# EAGLE design mainboard (EAGLE 9.3.1)
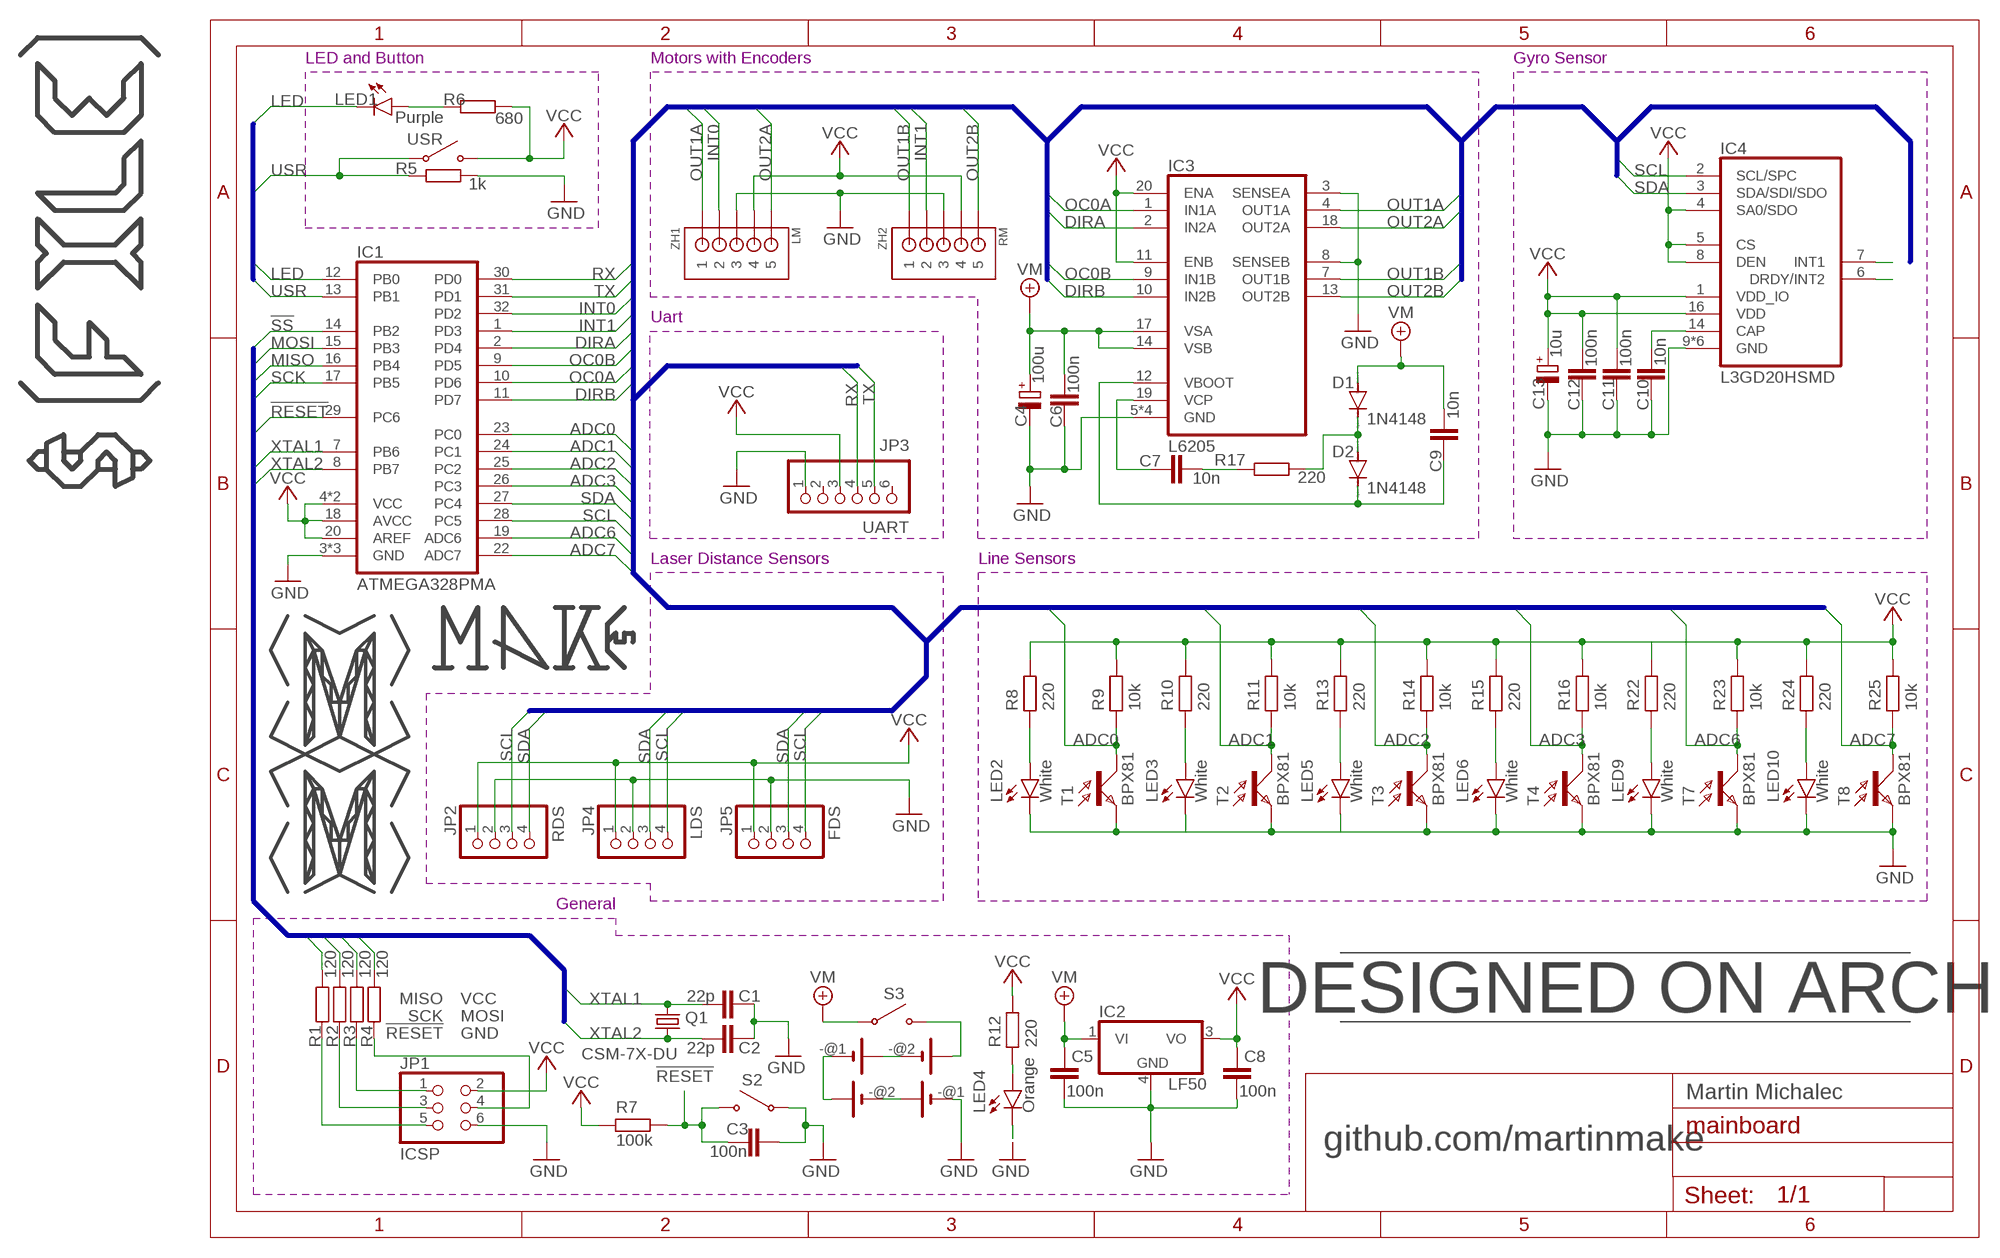
[diagram p0: schematic, sheet 1]

## Parts
BAT1  BATSERIES  [BAT2X18650SERIES]
BAT2  BATSERIES  [BAT2X18650SERIES]
C1  22p  C-EUC1206  [C1206]
C2  22p  C-EUC1206  [C1206]
C3  100n  C-EUC1206  [C1206]
C4  100u  CPOL-EUSMCD  [SMC_D]
C5  100n  C-EUC1206  [C1206]
C6  100n  C-EUC1206  [C1206]
C7  10n  C-EUC1206  [C1206]
C8  100n  C-EUC1206  [C1206]
C9  10n  C-EUC1206  [C1206]
C10  10n  C-EUC1206  [C1206]
C11  100n  C-EUC1206  [C1206]
C12  100n  C-EUC1206  [C1206]
C13  10u  CPOL-EUSMCD  [SMC_D]
D1  1N4148  1N4148DO35-7  [DO35-7]
D2  1N4148  1N4148DO35-7  [DO35-7]
IC1  ATMEGA328PMA  [TQFP32]
IC2  LF50  LM340MP-05  [SOT223]
IC3  L6205  [SO20]
IC4  L3GD20HSMD  [LGA-16]
JP1  ICSP  PINHD-2X3  [2X03]
JP2  RDS  PINHD-1X4/90  [1X04/90]
JP3  UART  PINHD-1X6/90  [1X06/90]
JP4  LDS  PINHD-1X4/90  [1X04/90]
JP5  FDS  PINHD-1X4/90  [1X04/90]
LED1  Purple  LEDSML1206  [SML1206]
LED2  White  LEDSML1206  [SML1206]
LED3  White  LEDSML1206  [SML1206]
LED4  Orange  LEDSML1206  [SML1206]
LED5  White  LEDSML1206  [SML1206]
LED6  White  LEDSML1206  [SML1206]
LED9  White  LEDSML1206  [SML1206]
LED10  White  LEDSML1206  [SML1206]
Q1  CSM-7X-DU  [CSM-7X-DU]
R1  120  R-EU_R1206  [R1206]
R2  120  R-EU_R1206  [R1206]
R3  120  R-EU_R1206  [R1206]
R4  120  R-EU_R1206  [R1206]
R5  1k  R-EU_R1206  [R1206]
R6  680  R-EU_R1206  [R1206]
R7  100k  R-EU_R1206  [R1206]
R8  220  R-EU_R1206  [R1206]
R9  10k  R-EU_R1206  [R1206]
R10  220  R-EU_R1206  [R1206]
R11  10k  R-EU_R1206  [R1206]
R12  220  R-EU_R1206  [R1206]
R13  220  R-EU_R1206  [R1206]
R14  10k  R-EU_R1206  [R1206]
R15  220  R-EU_R1206  [R1206]
R16  10k  R-EU_R1206  [R1206]
R17  220  R-EU_R1206  [R1206]
R22  220  R-EU_R1206  [R1206]
R23  10k  R-EU_R1206  [R1206]
R24  220  R-EU_R1206  [R1206]
R25  10k  R-EU_R1206  [R1206]
S2  SWITCHTHT  [SWITCH]
S3  SWITCHTHT  [SWITCH]
T1  BPX81  [BPX81]
T2  BPX81  [BPX81]
T3  BPX81  [BPX81]
T4  BPX81  [BPX81]
T7  BPX81  [BPX81]
T8  BPX81  [BPX81]
USR  SWITCHTHT  [SWITCH]
ZH1  LM  B5B-ZR  [B5B-ZR]
ZH2  RM  B5B-ZR  [B5B-ZR]

## Nets
!RESET: C3.1 IC1.29(PC6) R1.2 R7.2 S2.P$2
!SS: IC1.14(PB2)
ADC0: IC1.23(PC0) R9.2 T1.C
ADC1: IC1.24(PC1) R11.2 T2.C
ADC2: IC1.25(PC2) R14.2 T3.C
ADC3: IC1.26(PC3) R16.2 T4.C
ADC6: IC1.19(ADC6) R23.2 T7.C
ADC7: IC1.22(ADC7) R25.2 T8.C
DIRA: IC1.2(PD4) IC3.2(IN2A)
DIRB: IC1.11(PD7) IC3.10(IN2B)
GND: BAT2.-@1(A:-) C1.1 C2.1 C3.2 C4.- C5.2 C6.2 C8.2 C10.2 C11.2 C12.2 C13.- IC1.3(GND) IC1.5(GND) IC1.21(GND) IC2.4(GND) IC3.3(SENSEA) IC3.5(GND) IC3.6(GND) IC3.8(SENSEB) IC3.15(GND) IC3.16(GND) IC4.9(GND) IC4.10(GND) IC4.11(GND) IC4.12(GND) IC4.13(GND) IC4.15(GND) JP1.6 JP2.2 JP3.1 JP4.2 JP5.2 LED4.C R5.2 S2.P$1 ZH1.3 ZH2.3
GND2: LED2.C LED3.C LED5.C LED6.C LED9.C LED10.C T1.E T2.E T3.E T4.E T7.E T8.E ; supply symbol labelled GND
INT0: IC1.32(PD2) ZH1.2
INT1: IC1.1(PD3) ZH2.2
LED: IC1.12(PB0) LED1.C
MISO: IC1.16(PB4) R3.2
MOSI: IC1.15(PB3) R4.2
N$1: LED5.A R13.2
N$2: C9.1 D2.C IC3.12(VBOOT)
N$3: D1.C D2.A R17.2
N$4: C7.2 R17.1
N$5: LED1.A R6.1
N$6: C10.1 IC4.14(CAP)
N$7: C7.1 IC3.19(VCP)
N$9: BAT2.+@1(A:+) BAT2.-@2(B:-)
N$10: BAT1.+@1(A:+) BAT1.-@2(B:-)
N$11: IC4.6(DRDY/INT2)
N$12: LED6.A R15.2
N$13: IC4.7(INT1)
N$14: BAT1.+@2(B:+) S3.P$2
N$15: BAT1.-@1(A:-) BAT2.+@2(B:+)
N$22: LED10.A R24.2
N$24: R15.1
N$30: LED9.A R22.2
N$32: R13.1
N$33: JP1.1 R3.1
N$36: LED4.A R12.2
N$38: R22.1
N$40: R10.1
N$41: R24.1
N$43: LED3.A R10.2
N$45: R8.1
N$47: LED2.A R8.2
N$49: JP1.3 R2.1
N$50: JP1.5 R1.1
N$51: JP1.4 R4.1
OC0A: IC1.10(PD6) IC3.1(IN1A)
OC0B: IC1.9(PD5) IC3.9(IN1B)
OUT1A: IC3.4(OUT1A) ZH1.1
OUT1B: IC3.7(OUT1B) ZH2.1
OUT2A: IC3.18(OUT2A) ZH1.5
OUT2B: IC3.13(OUT2B) ZH2.5
RX: IC1.30(PD0) JP3.4
SCK: IC1.17(PB5) R2.2
SCL: IC1.28(PC5) IC4.2(SCL/SPC) JP2.3 JP4.4 JP5.4
SDA: IC1.27(PC4) IC4.3(SDA/SDI/SDO) JP2.4 JP4.3 JP5.3
TX: IC1.31(PD1) JP3.5
USR: IC1.13(PB1) R5.1 USR.P$1
VCC: C8.1 C11.1 C12.1 C13.+ IC1.4(VCC) IC1.6(VCC) IC1.18(AVCC) IC1.20(AREF) IC2.3(VO) IC3.11(ENB) IC3.20(ENA) IC4.1(VDD_IO) IC4.4(SA0/SDO) IC4.5(CS) IC4.8(DEN) IC4.16(VDD) JP1.2 JP2.1 JP3.3 JP4.1 JP5.1 R6.2 R7.1 R9.1 R11.1 R12.1 R14.1 R16.1 R23.1 R25.1 USR.P$2 ZH1.4 ZH2.4
VM: C4.+ C5.1 C6.1 C9.2 D1.A IC2.1(VI) IC3.14(VSB) IC3.17(VSA) S3.P$1
XTAL1: C1.2 IC1.7(PB6) Q1.2
XTAL2: C2.2 IC1.8(PB7) Q1.1
Unconnected: JP3.2 JP3.6

## Buses
MISO,MOSI,MOSIR,!RESET,SCK,!SS,XTAL1,XTAL2
ADC0,ADC1,ADC2,ADC3,ADC6,ADC7,DIRA,DIRB,INT0,INT1,OC0A,OC0B,OUT1A,OUT1B,OUT2A,OUT2B,RX,SCL,SDA,TX
LED,PB1,USR

## Notes on the sheet
- LED and Button | Motors with Encoders | Gyro Sensor
- Uart
- Laser Distance Sensors | Line Sensors
- General
- DESIGNED ON ARCH
- Martin Michalec
- github.com/martinmake

## Library data of the parts
BAT1 BAT2 = martinmake:BAT: LI BATTERY Varta
C1-C3 C5-C12 = rcl:C-EU: CAPACITOR, European symbol; SPICEPREFIX: C
C4 C13 = rcl:CPOL-EU: POLARIZED CAPACITOR, European symbol; SPICEPREFIX: C
D1 D2 = diode:1N4148: DIODE high speed (Philips)
IC1 = martinmake:ATMEGA328P: 32A, 32-lead, 7 x 7 mm Body Size, 1.0 mm Body Thickness, 0.8 mm Lead Pitch, Thin Profile Plastic Quad Flat Package (TQFP)
IC2 = linear:LM340?-*: Positive VOLTAGE REGULATOR Source: http://cache.national.com/ds/LM/LM340.pdf
IC3 = martinmake:L6205
IC4 = martinmake:L3GD20H
JP1 = pinhead:PINHD-2X3: PIN HEADER
JP2 JP4 JP5 = pinhead:PINHD-1X4: PIN HEADER
JP3 = pinhead:PINHD-1X6: PIN HEADER
LED1-LED6 LED9 LED10 = led:LED: LED OSRAM: - CHIPLED LG R971, LG N971, LY N971, LG Q971, LY Q971, LO R971, LY R971 LH N974, LH R974 LS Q976, LO Q976, LY Q976 LO Q996 - Hyper CHIPLED LW Q18S LB Q993, LB Q99A, LB R99A - SideLED LS A670, LO A670, LY A670, LG A670, LP A670 LB A673, LV A673, LT A673, LW A673 LH A674 LY A675 LS A676, LA A676, LO A676, LY A676, LW A676 LS A679, LY A679, LG A679 - Hyper Micro SIDELED® LS Y876, LA Y876, LO Y876, LY Y876 LT Y87S - SmartLED LW L88C, LW L88S LB L89C, LB L89S, LG L890 LS L89K, LO L89K, LY L89K LS L896, LA L896, LO L896, LY L896 - TOPLED LS T670, LO T670, LY T670, LG T670, LP T670 LSG T670, LSP T670, LSY T670, LOP T670, LYG T670 LG T671, LOG T671, LSG T671 LB T673, LV T673, LT T673, LW T673 LH T674 LS T676, LA T676, LO T676, LY T676, LB T676, LH T676, LSB T676, LW T676 LB T67C, LV T67C, LT T67C, LS T67K, LO T67K, LY T67K, LW E67C LS E67B, LA E67B, LO E67B, LY E67B, LB E67C, LV E67C, LT E67C LW T67C LS T679, LY T679, LG T679 LS T770, LO T770, LY T770, LG T770, LP T770 LB T773, LV T773, LT T773, LW T773 LH T774 LS E675, LA E675, LY E675, LS T675 LS T776, LA T776, LO T776, LY T776, LB T776 LHGB T686 LT T68C, LB T68C - Hyper Mini TOPLED® LB M676 - Mini TOPLED Santana® LG M470 LS M47K, LO M47K, LY M47K Source: http://www.osram.convergy.de LUXEON: - LUMILED® LXK2-PW12-R00, LXK2-PW12-S00, LXK2-PW14-U00, LXK2-PW14-V00 LXK2-PM12-R00, LXK2-PM12-S00, LXK2-PM14-U00 LXK2-PE12-Q00, LXK2-PE12-R00, LXK2-PE12-S00, LXK2-PE14-T00, LXK2-PE14-U00 LXK2-PB12-K00, LXK2-PB12-L00, LXK2-PB12-M00, LXK2-PB14-N00, LXK2-PB14-P00, LXK2-PB14-Q00 LXK2-PR12-L00, LXK2-PR12-M00, LXK2-PR14-Q00, LXK2-PR14-R00 LXK2-PD12-Q00, LXK2-PD12-R00, LXK2-PD12-S00 LXK2-PH12-R00, LXK2-PH12-S00 LXK2-PL12-P00, LXK2-PL12-Q00, LXK2-PL12-R00 Source: www.luxeon.com KINGBRIGHT: KA-3528ASYC Source: www.kingbright.com
Q1 = crystal:CSM-7X-DU: SMD CRYSTAL Source: www.ecsxtal.com .. Crystal 3.6864MHz CSM_7X_DU.PDF; OC_FARNELL: unknown; OC_NEWARK: unknown
R1-R17 R22-R25 = rcl:R-EU_: RESISTOR, European symbol; SPICEPREFIX: R
S2 S3 USR = martinmake:SWITCH
T1-T4 T7 T8 = opto-trans-siemens:BPX81: PHOTO TRANSISTOR; OC_FARNELL: unknown; OC_NEWARK: unknown
ZH1 ZH2 = jst:B5B-ZR: JST-ZH Connector 5 pol, 1.5mm pitch Package: B5B-ZR Source: http://www.jst-mfg.com/product/pdf/eng/eZH.pdf

## Board
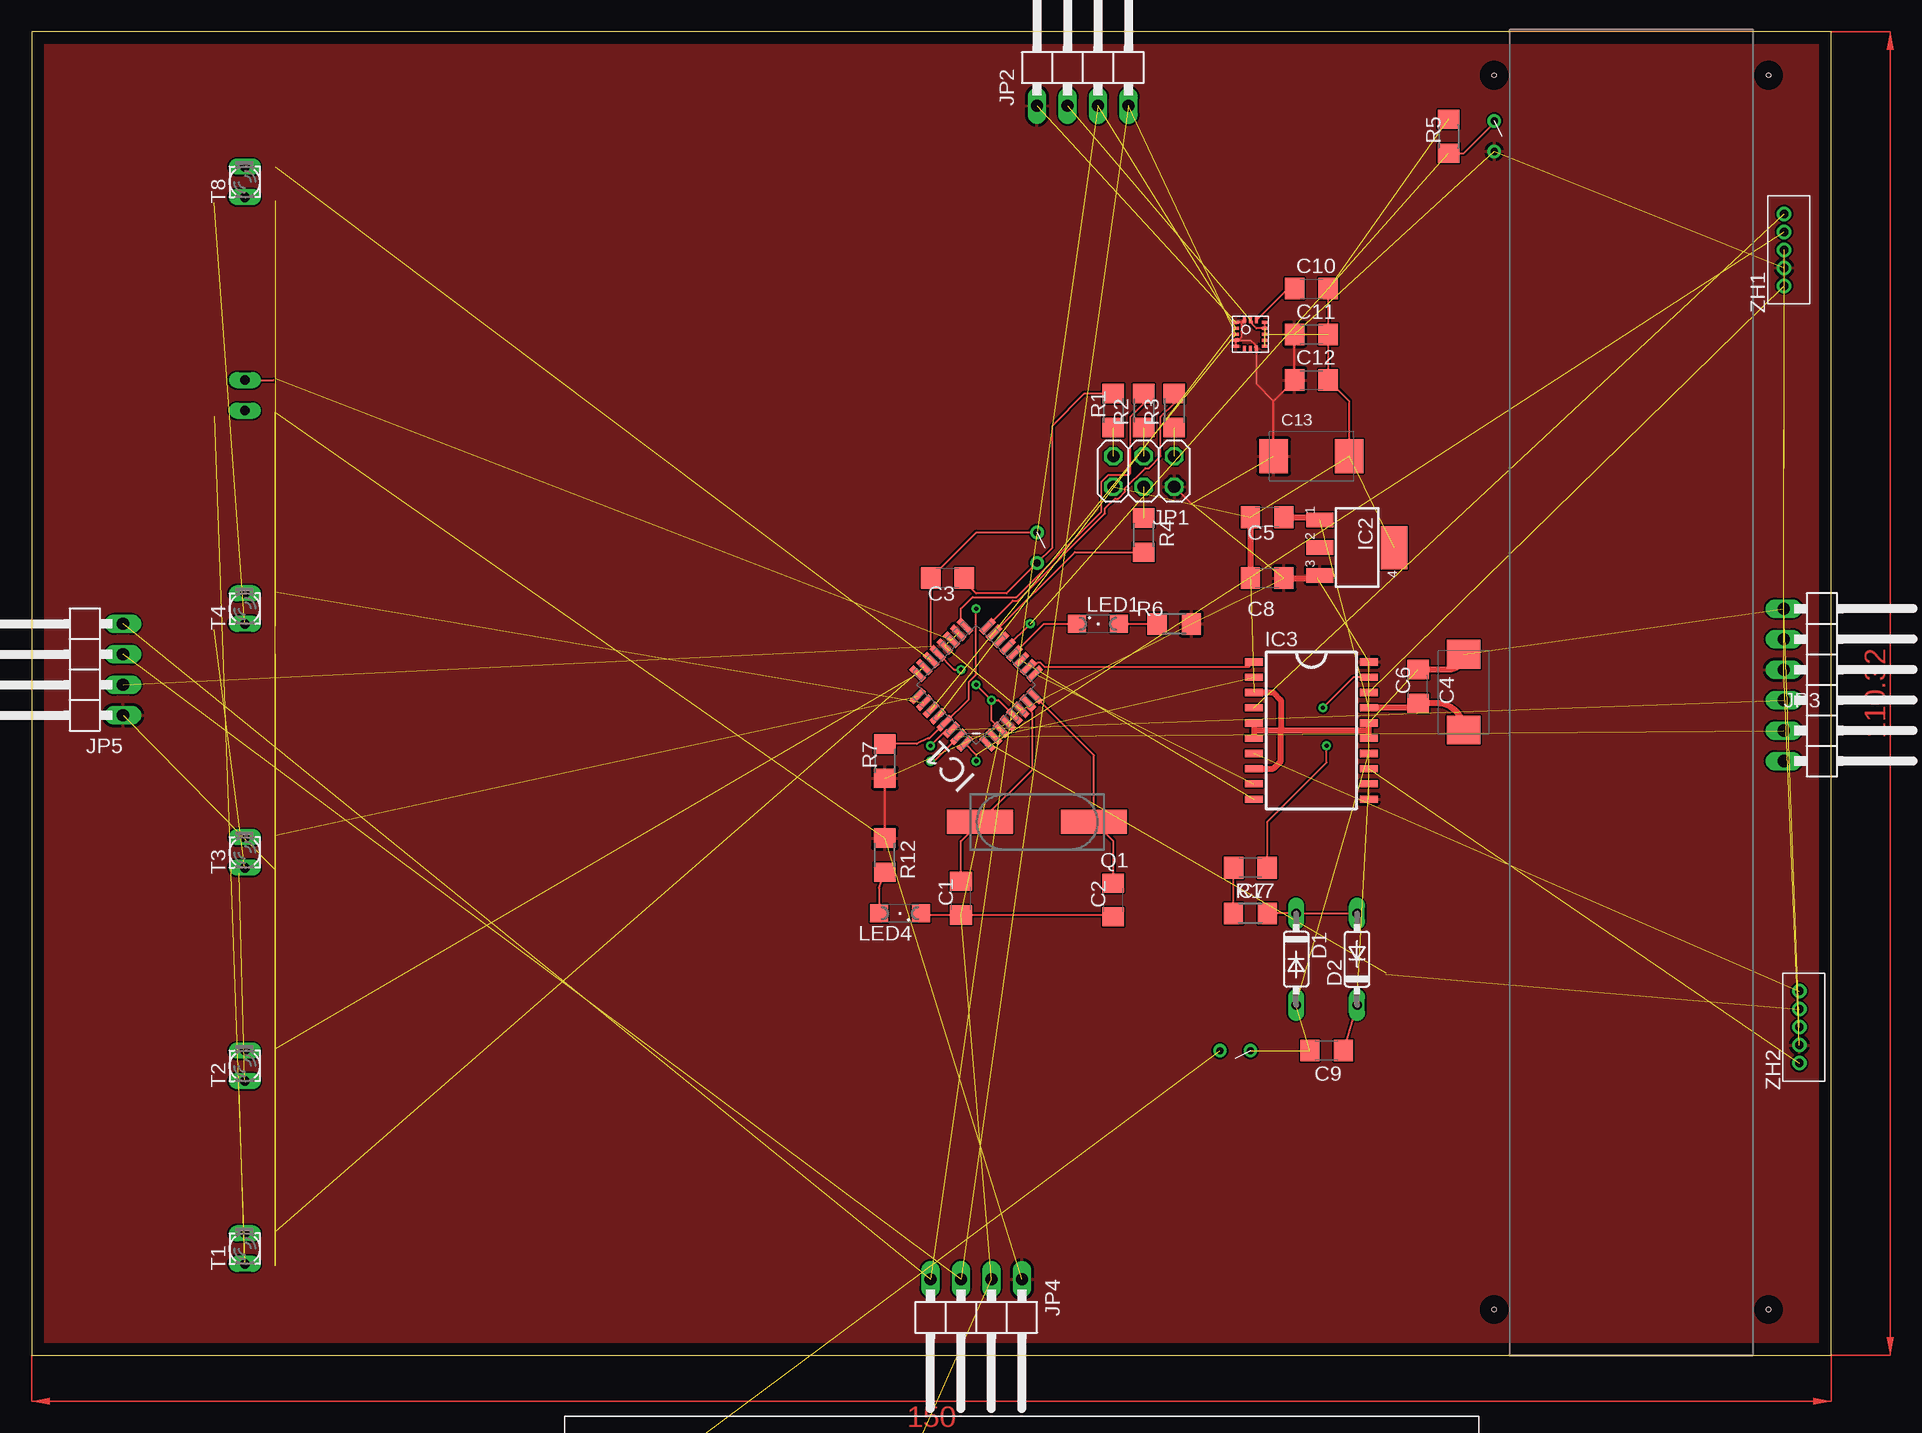
[diagram p1: board, top side]
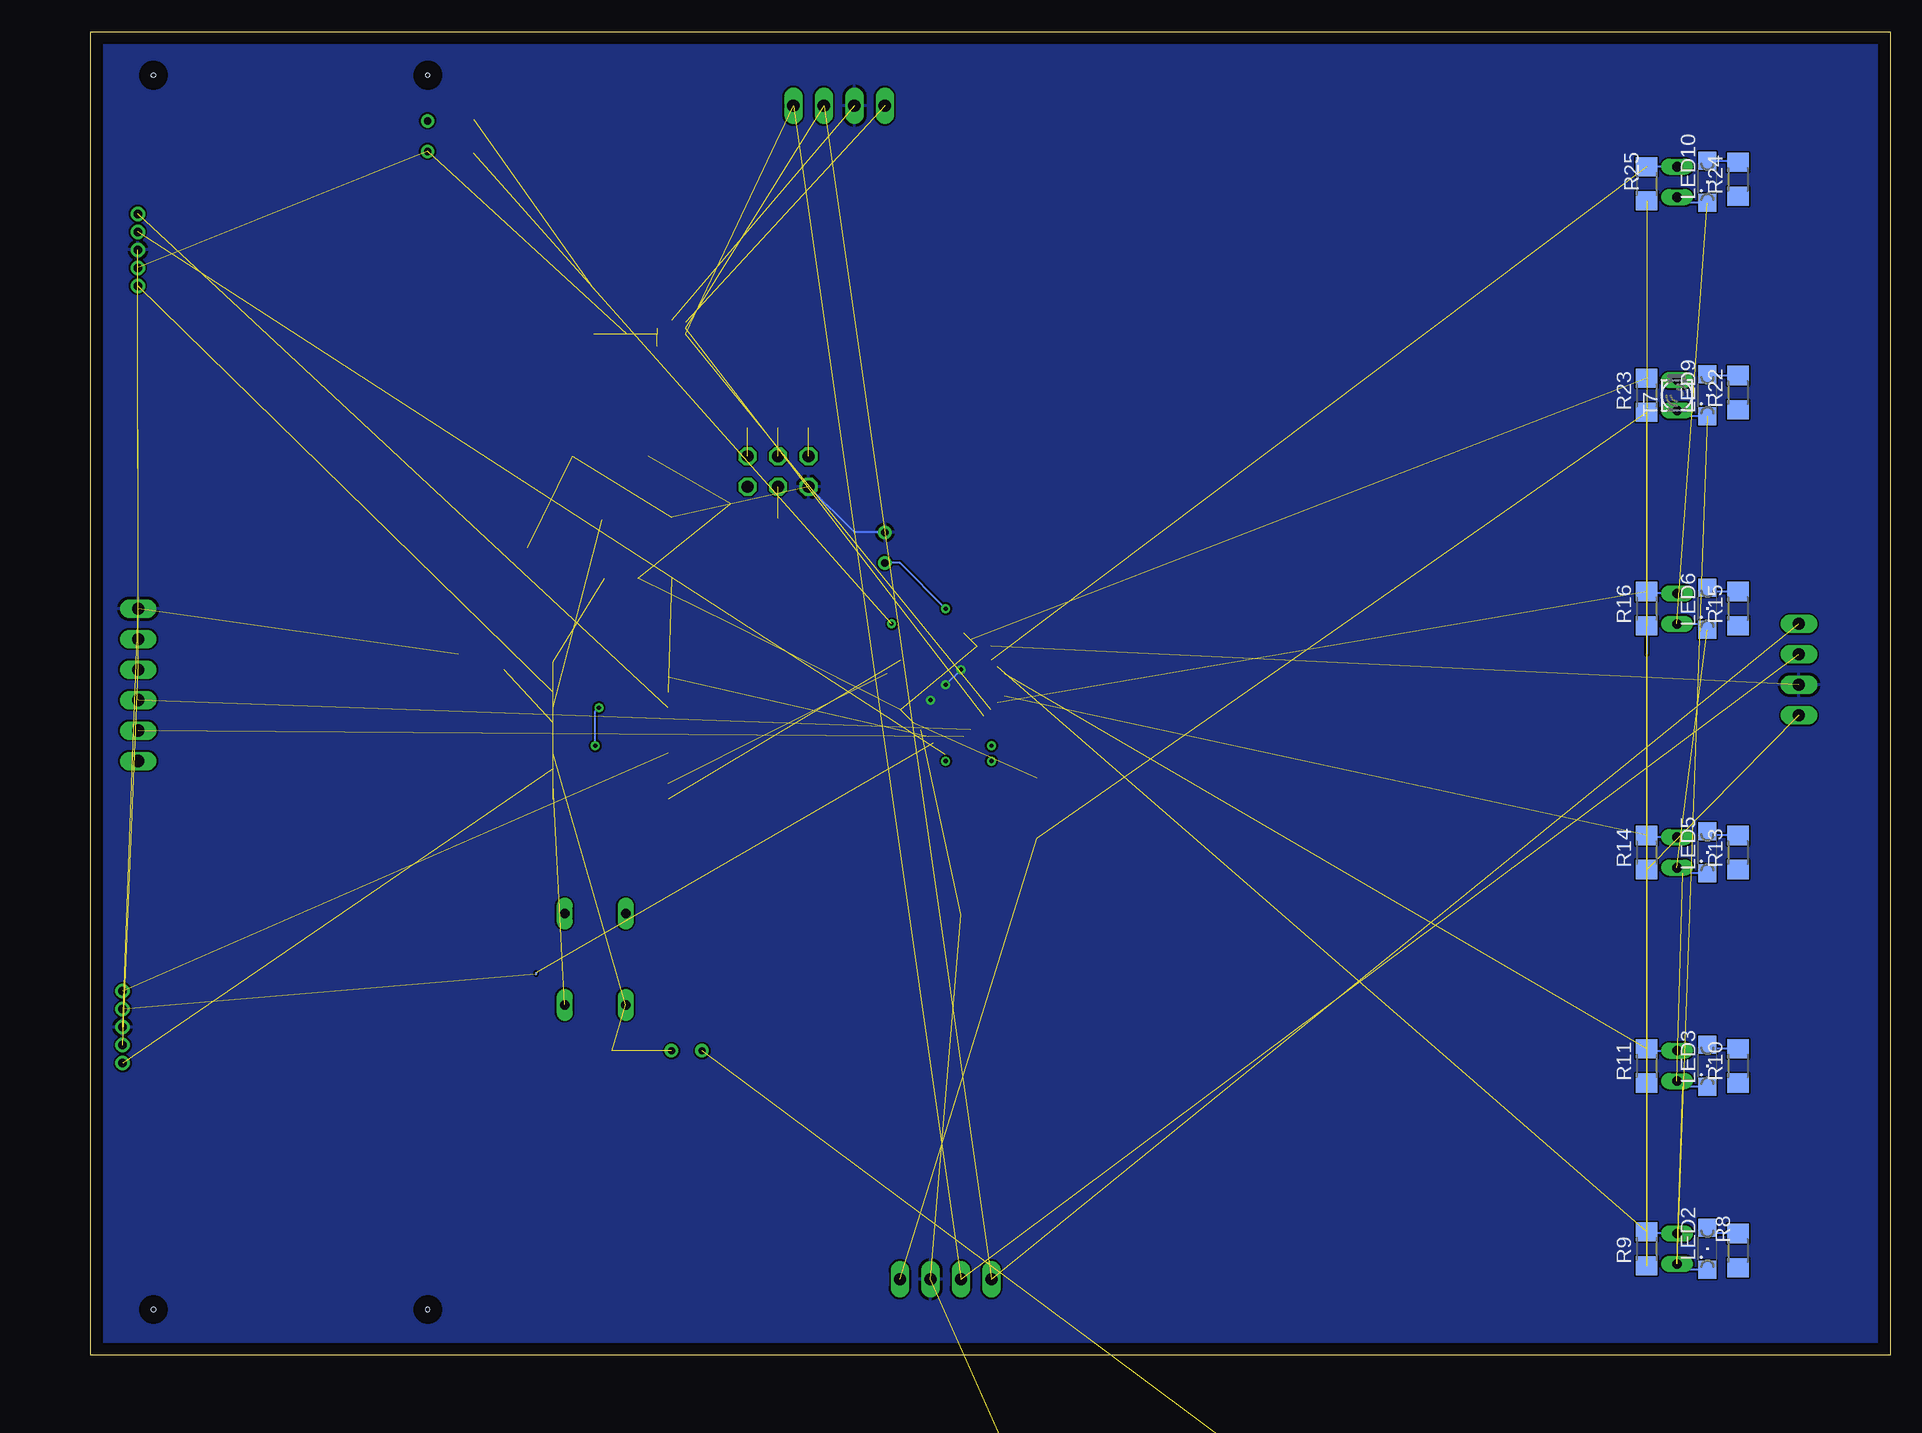
[diagram p2: board, bottom side, seen from below]

Size 150 x 110.32 mm. Coordinates in mm from the lower left corner, seen from the top.
Outline: 0,0 150,0 150,110.32 0,110.32 0,0
Copper layers (1*16): Top 0.035mm / dielectric 1.5mm / Bottom 0.035mm
Design rules "default": minimum track width 6mil, minimum drill 0.35mm, track to track 6mil, track to pad 6mil, pad to pad 6mil, via to via 6mil, smd to smd 6mil, copper to edge 40mil, drill to drill 6mil, minimum pad ring 10mil, minimum via ring 8mil, stop-mask expansion 4mil, vias tented up to drill 0mil, thermal gap 10mil
Holes 0.35 mm at 121.92,3.81 144.78,3.81 121.92,106.68 144.78,106.68

### Footprints (pad centres in the part's own frame; a part is rotated, then mirrored left to right if it is on the bottom)
BAT2X18650SERIES = drill 1.6 pad 3: +@1 -36.83,10.16; +@2 39.37,-8.89; -@1 39.37,10.16; -@2 -36.83,-8.89 | hole 3: 30.48,-8.89; -25.4,-8.89; -27.94,10.16; 27.94,10.16
C1206 = smd 1.6 x 1.8: 1 -1.4,0; 2 1.4,0
SMC_D = smd 2.4 x 2.8: + -3.15,0; - 3.15,0
DO35-7 = drill 0.813 long: A 3.81,0; C -3.81,0
TQFP32 = smd 1.473 x 0.508: 1 -4.115,2.794; 2 -4.115,2.007; 3 -4.115,1.194; 4 -4.115,0.406; 5 -4.115,-0.406; 6 -4.115,-1.194; 7 -4.115,-2.007; 8 -4.115,-2.794; 17 4.115,-2.794; 18 4.115,-2.007; 19 4.115,-1.194; 20 4.115,-0.406; 21 4.115,0.406; 22 4.115,1.194; 23 4.115,2.007; 24 4.115,2.794 | smd 0.508 x 1.473: 9 -2.794,-4.115; 10 -2.007,-4.115; 11 -1.194,-4.115; 12 -0.406,-4.115; 13 0.406,-4.115; 14 1.194,-4.115; 15 2.007,-4.115; 16 2.794,-4.115; 25 2.794,4.115; 26 2.007,4.115; 27 1.194,4.115; 28 0.406,4.115; 29 -0.406,4.115; 30 -1.194,4.115; 31 -2.007,4.115; 32 -2.794,4.115
SOT223 = smd 1.219 x 2.235: 1 -2.311,-3.099; 2 0,-3.099; 3 2.311,-3.099 | smd 3.6 x 2.2: 4 0,3.099
SO20 = smd 0.6 x 1.5: 1 -5.715,-4.78; 2 -4.445,-4.78; 3 -3.175,-4.78; 4 -1.905,-4.78; 5 -0.635,-4.78; 6 0.635,-4.78; 7 1.905,-4.78; 8 3.175,-4.78; 9 4.445,-4.78; 10 5.715,-4.78; 11 5.715,4.78; 12 4.445,4.78; 13 3.175,4.78; 14 1.905,4.78; 15 0.635,4.78; 16 -0.635,4.78; 17 -1.905,4.78; 18 -3.175,4.78; 19 -4.445,4.78; 20 -5.715,4.78
LGA-16 = smd 0.5 x 0.25: 1 -1.19,1; 2 -1.19,0.5; 3 -1.19,0; 4 -1.19,-0.5; 5 -1.19,-1; 9 1.19,-1; 10 1.19,-0.5; 11 1.19,0; 12 1.19,0.5; 13 1.19,1 | smd 0.25 x 0.5: 6 -0.5,-1.19; 7 0,-1.19; 8 0.5,-1.19; 14 0.5,1.19; 15 0,1.19; 16 -0.5,1.19
2X03 = drill 1.016 octagon: 1 -2.54,-1.27; 2 -2.54,1.27; 3 0,-1.27; 4 0,1.27; 5 2.54,-1.27; 6 2.54,1.27
1X04/90 = drill 1.016 long: 1 -3.81,-3.81; 2 -1.27,-3.81; 3 1.27,-3.81; 4 3.81,-3.81
1X06/90 = drill 1.016 long: 1 -6.35,-3.81; 2 -3.81,-3.81; 3 -1.27,-3.81; 4 1.27,-3.81; 5 3.81,-3.81; 6 6.35,-3.81
SML1206 = smd 1.5 x 1.5: A 1.75,0; C -1.75,0
CSM-7X-DU = smd 5.5 x 2: 1 -4.75,0; 2 4.75,0
R1206 = smd 1.6 x 1.803: 1 -1.422,0; 2 1.422,0
SWITCH = drill 0.6: P$1 -1.27,0; P$2 1.27,0
BPX81 = drill 0.813 long: C 1.27,0; E -1.27,0
B5B-ZR = drill 0.7: 1 7.5,-1.3; 2 6,-1.3; 3 4.5,-1.3; 4 3,-1.3; 5 1.5,-1.3

### Placement (x,y rotation side)
BAT1  83.82,-24.13 180 top  (outside the outline)
BAT2  83.82,-63.5 180 top  (outside the outline)
C1  77.47,38.1 90 top
C2  90.17,37.95 90 top
C3  76.35,64.77 180 top
C4  119.38,55.27 90 top
C5  103,69.85 180 top
C6  115.57,55.75 90 top
C7  101.6,40.64 180 top
C8  103,64.77 180 top
C9  107.95,25.4 180 top
C10  106.68,88.9 0 top
C11  106.68,85.09 0 top
C12  106.68,81.28 0 top
C13  106.68,74.93 0 top
D1  105.41,33.02 270 top
D2  110.49,33.02 90 top
IC1  78.74,55.88 135 top
IC2  110.49,67.31 270 top
IC3  106.68,52.07 270 top
IC4  101.6,85.09 0 top
JP1  92.71,73.66 180 top
JP2  87.63,107.95 0 top
JP3  149.86,55.88 270 top
JP4  78.74,2.54 180 top
JP5  3.81,57.15 90 top
LED1  88.9,60.96 0 top
LED2  15.24,8.89 90 bottom
LED3  15.24,24.13 90 bottom
LED4  72.39,36.83 180 top
LED5  15.24,41.91 90 bottom
LED6  15.24,62.23 90 bottom
LED9  15.24,80.01 90 bottom
LED10  15.24,97.79 90 bottom
Q1  83.82,44.45 180 top
R1  90.17,78.74 90 top
R2  92.71,78.74 90 top
R3  95.25,78.74 90 top
R4  92.71,68.36 270 top
R5  118.11,101.6 90 top
R6  95.25,60.96 0 top
R7  71.12,49.53 90 top
R8  12.7,8.74 90 bottom
R9  20.32,8.89 90 bottom
R10  12.7,24.13 90 bottom
R11  20.32,24.13 90 bottom
R12  71.12,41.69 270 top
R13  12.7,41.91 90 bottom
R14  20.32,41.91 90 bottom
R15  12.7,62.23 90 bottom
R16  20.32,62.23 90 bottom
R17  101.6,36.83 0 top
R22  12.7,80.23 90 bottom
R23  20.32,80.01 90 bottom
R24  12.7,98.01 90 bottom
R25  20.32,97.64 90 bottom
S2  83.82,67.31 270 top
S3  100.33,25.4 180 top
T1  17.78,8.89 90 top
T2  17.78,24.13 90 top
T3  17.78,41.91 90 top
T4  17.78,62.23 90 top
T7  17.78,80.01 90 bottom
T8  17.78,97.79 90 top
USR  121.92,101.6 270 top
ZH1  144.78,87.63 90 top
ZH2  146.05,22.86 90 top

### Tracks (layer width: path | path; a pad name or v marks a point on that pad's centre or on a via)
!RESET  (via drill 0.35)
  Top 0.152: R7.2 73.77,50.95 74.73,51.41 74.85,51.41 IC1.29 78.13,54.7 78.13,56.13 78.74,56.74 v78.74,62.23 | C3.1 77.75,64.49 78.74,63.5 81.28,63.5 S2.P$2 85.09,67.31 85.09,77.47 87.78,80.16 R1.2
  Bottom 0.152: v78.74,62.23 82.55,66.04 S2.P$2
ADC0  (1 unrouted)
  Bottom 0.152: T1.C 20.17,10.16 R9.2
ADC1  (1 unrouted)
  Bottom 0.152: R11.2 20.17,25.4 T2.C
ADC2  (1 unrouted)
  Bottom 0.152: T3.C 20.17,43.18 R14.2
ADC3  (1 unrouted)
  Bottom 0.152: T4.C 20.17,63.5 R16.2
ADC6  (1 unrouted)
  Top 0.152: T7.C 20.17,81.28
  Bottom 0.152: 20.17,81.28 R23.2
ADC7  (1 unrouted)
  Bottom 0.152: T8.C R25.2
DIRA  (1 unrouted)
DIRB  (1 unrouted)
GND  (via drill 0.35)  (18 unrouted)
  Top 0.152: IC1.5 | IC1.3 80.01,52.92 v80.01,54.61 | v80.01,54.61 80.58,54.61 IC1.5 | C2.1 90.02,36.7 C1.1 74.27,36.7 LED4.C | S2.P$1 78.76,68.58 C3.2 74.95,59.09 IC1.21 76.89,57.15 v77.47,57.15 | v78.74,55.88 v80.01,54.61 | C13.- 109.83,79.53 C12.2 C11.2 C10.2 | IC4.9 IC4.13 | IC4.15 101.75,86.13 101.75,85.94 102.09,85.59 IC4.12
  Top 0.5: C4.- arc-90 118.11,57.15 C6.2 | C5.2 C8.2 | IC3.5 101.9,52.07 | 101.9,52.07 IC3.6 | IC3.15 111.46,52.07 | 111.46,52.07 IC3.16 | 111.46,52.07 104.14,52.07 | 104.14,52.07 101.9,52.07 | IC3.3 103.5,55.24 104.14,54.61 104.14,52.07 | IC3.8 103.5,48.9 104.14,49.53 104.14,52.07
  Bottom 0.152: S2.P$1 86.36,68.58 JP1.6 | v77.47,57.15 v78.74,55.88
  pour Bottom: 0,0 150,0 150,110.32 0,110.32
GND2  (5 unrouted)
  Top 0.152: 17.3,78.26 T7.E
  Bottom 0.152: LED10.C 17.3,96.04 T8.E | LED9.C 17.3,78.26 | LED3.C 17.3,22.38 T2.E | LED5.C 17.3,40.16 T3.E | LED2.C 17.3,7.14 T1.E | T4.E 15.72,60.96 LED6.C
INT0  (via drill 0.35)  (1 unrouted)
  Top 0.152: IC1.32 78.74,50.06 v78.74,49.53
INT1  (2 unrouted)
  Top 0.152: IC1.1 79.81,50.99
  Bottom 0.152: 112.89,31.89 112.89,31.75
LED
  Top 0.152: IC1.12 84.39,60.96 LED1.C
MISO
  Top 0.152: R3.2 95.25,79.34 94.12,78.21 94.12,74.94 93.12,73.94 92.85,73.94 91.16,72.25 91.16,71.98 90.58,71.4 90.31,71.4 89.48,70.58 89.48,70.17 82.21,62.89 81.8,62.89 IC1.16
MOSI
  Top 0.152: IC1.15 86.96,66.94 R4.2
N$1
  Bottom 0.152: R13.2 14.91,43.33 LED5.A
N$2  (1 unrouted)
  Top 0.152: D2.C C9.1
N$3
  Top 0.152: R17.2 D1.C D2.A
N$4
  Top 0.152: R17.1 100.2,36.85 C7.2
N$5
  Top 0.152: LED1.A R6.1
N$6
  Top 0.152: C10.1 104.72,88.9 IC4.14
N$7  (via drill 0.35)
  Top 0.152: IC3.19 110.19,56.52 v107.65,53.98 | C7.1 103,44.45 107.95,49.4 v107.95,50.8
  Bottom 0.152: v107.65,53.98 107.95,53.67 v107.95,50.8
N$9  (1 unrouted)
N$10  (1 unrouted)
N$12
  Bottom 0.152: R15.2 14.91,63.65 LED6.A
N$14  (1 unrouted)
N$15  (1 unrouted)
N$22
  Bottom 0.152: LED10.A 12.81,99.54 R24.2
N$30
  Bottom 0.152: R22.2 15.13,81.65 LED9.A
N$33  (1 unrouted)
N$36
  Top 0.152: LED4.A 70.64,38.95 R12.2
N$43
  Bottom 0.152: R10.2 14.91,25.55 LED3.A
N$47
  Bottom 0.152: R8.2 14.76,10.16 LED2.A
N$49  (1 unrouted)
N$50  (1 unrouted)
N$51  (1 unrouted)
OC0A
  Top 0.152: IC3.1 101.49,57.37 84.43,57.37 84.06,57.74 83.87,57.74 83.5,57.37 IC1.10
OC0B  (1 unrouted)
OUT1A  (1 unrouted)
OUT1B  (1 unrouted)
OUT2A  (1 unrouted)
OUT2B  (1 unrouted)
RX  (via drill 0.35)  (1 unrouted)
  Top 0.152: v74.93,50.8 76.26,52.13 IC1.30
SCK
  Top 0.152: IC1.17 77.47,61.1 77.47,62.23 78.44,63.2 82.08,63.2 89.18,70.29 89.18,72.8 89.76,73.38 91.47,73.38 91.58,73.5 91.58,78.21 92.71,79.34 R2.2 92.19,80.16
SCL  (4 unrouted)
SDA  (4 unrouted)
TX  (via drill 0.35)  (1 unrouted)
  Top 0.152: v74.93,49.53 75.23,49.53 IC1.31
USR  (via drill 0.35)  (1 unrouted)
  Top 0.152: IC1.13 v83.25,60.96 | USR.P$1 121.92,102.74 121.35,102.15 119.38,100.18 R5.1
VCC  (23 unrouted)
  Top 0.152: R12.1 R7.1 | 96.67,70.97 JP1.2 | C11.1 C12.1 103.53,79.53 | C13.+ 103.53,79.53 | 103.53,79.53 102.1,80.96 IC4.8 101.95,84.05 101.95,84.25 101.61,84.59 IC4.4 | IC4.5 IC4.4 | IC4.4 100.56,84.74 100.75,84.74 100.89,84.87 100.89,86.07 IC4.16 100.91,86.09 IC4.1
  Top 0.5: C8.1 107.16,64.77 IC2.3
  Bottom 0.152: R16.1 20.32,58.42
  pour Top: 0,110.32 150,110.32 150,0 0,0
VM  (5 unrouted)
  Top 0.152: 107.16,69.85 IC2.1
  Top 0.5: C4.+ arc90 117.15,54.35 C6.1 arc-90 115.19,53.98 IC3.17 | C5.1 107.16,69.85
XTAL1
  Top 0.152: C1.2 77.47,42.85 Q1.2 83.42,48.8 83.42,53.57 83.07,53.92 IC1.7
XTAL2
  Top 0.152: C2.2 90.17,42.85 Q1.1 88.57,50 IC1.8
(copper drawn outside any net)
  shapes: Top area x2